# Altium schematic sheet AC DC Powersupply.SchDoc: AC DC Powersupply
size A4; SheetNumber: 10; SheetTotal: 10
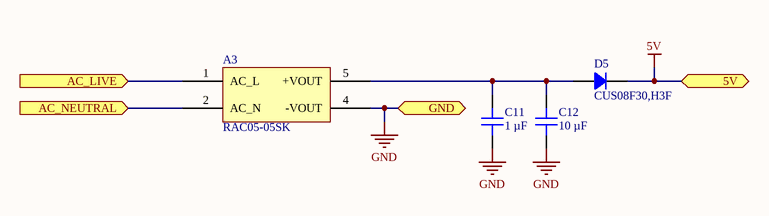
[diagram p0: AC DC Powersupply.SchDoc]

## Parts
A3  RAC05-05SK  [RECOM RAC05-K]
C11  1 µF  [CAP 0805_2012]
C12  10 µF  [CAP 0805_2012]
D5  CUS08F30,H3F  [SOD323]

## Ports
5V (bidir, see Review[2D], AC Detection[1A], Connectors[3A], Opto[1B], SSR Control[1A], Supply 5V[2B], Supply 15V[2B]), AC_LIVE (in, see Review[2D], AC Detection[3B], SSR Control[3D], SSR[2B]), AC_NEUTRAL (in, see Review[2D], AC Detection[3C]), GND (bidir, see Review[2D], AC Detection[1A], Connectors[3D], Supply 5V[2C], Supply 15V[2C])

## Nets
5V: D5.2 ; port 5V
GND: A3.4(-VOUT) C11.1 C12.1 ; port GND
AC_LIVE: A3.1(AC_L) ; port AC_LIVE
AC_NEUTRAL: A3.2(AC_N) ; port AC_NEUTRAL
NetA3_5: A3.5(+VOUT) C11.2 C12.2 D5.1

## Notes on the sheet
- Title
- Size:
- Date:
- A4
- Number:
- Time:
- Revision:
- Sheet
- of
- File:

## Library data of the parts
A3 = RAC05-05SK: AC/DC CONVERTER 5V 5W; Manufacturer: Recom Power; Current - Output (Max): 1A; Efficiency: 80%; Number of Outputs: 1; Voltage - Input: 85 ~ 264 VAC, 120 ~ 370 VDC; Applications: ITE (Commercial); ComponentLink1Description: Datasheet; ComponentLink1URL: https://www.recom-power.com/pdf/Powerline-AC-DC/RAC05-K.pdf; ComponentLink2Description: DigiKey Link; ComponentLink2URL: http://digikey.com/product-detail/en/recom-power/RAC05-05SK/945-3119-5-ND/7603372; Features: DC Input Capable, Universal Input; LastUpdated: 16/10/2023 19:45:24; Lifecycle Status: Active; Part Number: RAC05-05SK; Minimum Order: 1; Mounting Type: Through Hole; Operating Temperature: -25°C ~ 70°C (With Derating); Package / Case: 5-DIP Module; Packaging: Unknown; Part Status: Active; Power (Watts): 5W; Price: 9.63; Series: POWERLINE RAC05-K (5W); Size / Dimension: 1.00" L x 1.00" W x 0.65" H (25.4mm x 25.4mm x 16.5mm); Supplier 1: DigiKey; Supplier Part Number 1: 945-3119-5-ND; Type: Enclosed; Voltage - Output 1: 5V
C11 = GCJ21BR71H105KA01L: CAP CER 1UF 50V X7R 0805; manufacturer: Murata Electronics; Tolerance: ±10%; Part Number: GCJ21BR71H105KA01L; Value: 1 µF; Applications: Automotive, Boardflex Sensitive; Capacitance: 1 µF; componentlink1description: Datasheet; componentlink1url: https://www.murata.com/~/media/webrenewal/support/library/catalog/products/capacitor/mlcc/c03e.ashx?la=en-us; componentlink2description: DigiKey Link; componentlink2url: https://www.digikey.com/en/products/detail/murata-electronics/GCJ21BR71H105KA01L/4903512; Device Package: 0805 (2012 Metric); Features: Soft Termination; lastupdated: 5/12/2023 7:17:22 PM; Lifecycle Status: Active; Minimum Order: 1; Mounting Type: Surface Mount, MLCC; Operating Temperature: -55°C ~ 125°C; Package / Case: 0805 (2012 Metric); packaging: TapeAndReel; partid: 2709; Part Status: Active; price: 0.05; Ratings: AEC-Q200; series: GCJ; Size / Dimension: 0.079" L x 0.049" W (2.00mm x 1.25mm); Supplier 1: DigiKey; Supplier Part Number 1: 490-10667-1-ND; Temperature Coefficient: X7R; Thickness (Max): 0.057" (1.45mm); Voltage - Rated: 50V
C12 = CL21A106KOQNNNE: CAP CER 10UF 16V X5R 0805; manufacturer: Samsung Electro-Mechanics; Tolerance: ±10%; Part Number: CL21A106KOQNNNE; Value: 10 µF; Applications: General Purpose; Capacitance: 10 µF; componentlink1description: Datasheet; componentlink1url: http://www.samsungsem.com/kr/support/product-search/mlcc/CL21A106KOQNNNE.jsp; componentlink2description: DigiKey Link; componentlink2url: https://www.digikey.com/en/products/detail/samsung-electro-mechanics/CL21A106KOQNNNE/3886754; Device Package: 0805 (2012 Metric); lastupdated: 16/10/2023 19:12:13; Lifecycle Status: Active; Minimum Order: 1; Mounting Type: Surface Mount, MLCC; Operating Temperature: -55°C ~ 85°C; Package / Case: 0805 (2012 Metric); packaging: TapeAndReel; partid: 14297; Part Status: Active; price: 0.01; series: CL; Size / Dimension: 0.079" L x 0.049" W (2.00mm x 1.25mm); Supplier 1: DigiKey; Supplier Part Number 1: 1276-1096-1-ND; Temperature Coefficient: X5R; Thickness (Max): 0.055" (1.40mm); Voltage - Rated: 16V
D5 = CUS08F30,H3F: DIODE SCHOTTKY 30V 800MA USC; Manufacturer: Toshiba Semiconductor and Storage; Capacitance @ Vr, F: 170pF @ 0V, 1MHz; Current - Reverse Leakage @ Vr: 50 µA @ 30 V; Speed: Fast Recovery =< 500ns, > 200mA (Io); Voltage - Forward (Vf) (Max) @ If: 220 mV @ 10 mA; Part Number: CUS08F30,H3F; ComponentLink1Description: Datasheet; ComponentLink1URL: https://toshiba.semicon-storage.com/info/docget.jsp?did=9019&prodName=CUS08F30; ComponentLink2Description: DigiKey Link; ComponentLink2URL: https://www.digikey.com/en/products/detail/toshiba-semiconductor-and-storage/CUS08F30-H3F/5114298; Current - Average Rectified (Io): 800mA; Diode Type: Schottky; LastUpdated: 15/10/2023 20:39:09; Lifecycle Status: Active; Minimum Order: 1; Mounting Type: Surface Mount; Operating Temperature - Junction: 125°C (Max); Package / Case: SC-76, SOD-323; Packaging: TapeAndReel; PartId: 3013; Part Status: Active; Price: 0.04; Series: -; Supplier 1: DigiKey; Supplier Part Number 1: CUS08F30H3FCT-ND; Supplier Device Package: USC; Voltage - DC Reverse (Vr) (Max): 30 V